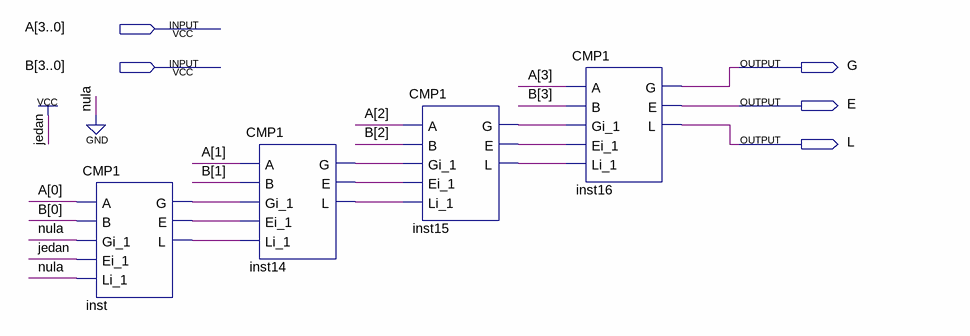
[diagram p0: schematic sheet]
// Quartus schematic CMP4.bdf as structural Verilog: 4 symbols, 5 pins
module CMP4 (
  input  [3:0] A,
  input  [3:0] B,
  output G,
  output E,
  output L
);

  wire inst14_e, inst14_g, inst14_l, inst15_e, inst15_g, inst15_l, inst_e, inst_g, inst_l;

  CMP1 inst (.A(A[0]), .B(B[0]), .Gi_1(1'b0), .Ei_1(1'b1), .Li_1(1'b0), .G(inst_g), .E(inst_e), .L(inst_l));
  CMP1 inst14 (
    .A(A[1]), .B(B[1]), .Gi_1(inst_g), .Ei_1(inst_e), .Li_1(inst_l), .G(inst14_g), .E(inst14_e), .L(inst14_l));
  CMP1 inst15 (
    .A(A[2]), .B(B[2]), .Gi_1(inst14_g), .Ei_1(inst14_e), .Li_1(inst14_l), .G(inst15_g), .E(inst15_e),
    .L(inst15_l));
  CMP1 inst16 (.A(A[3]), .B(B[3]), .Gi_1(inst15_g), .Ei_1(inst15_e), .Li_1(inst15_l), .G(G), .E(E), .L(L));
endmodule
